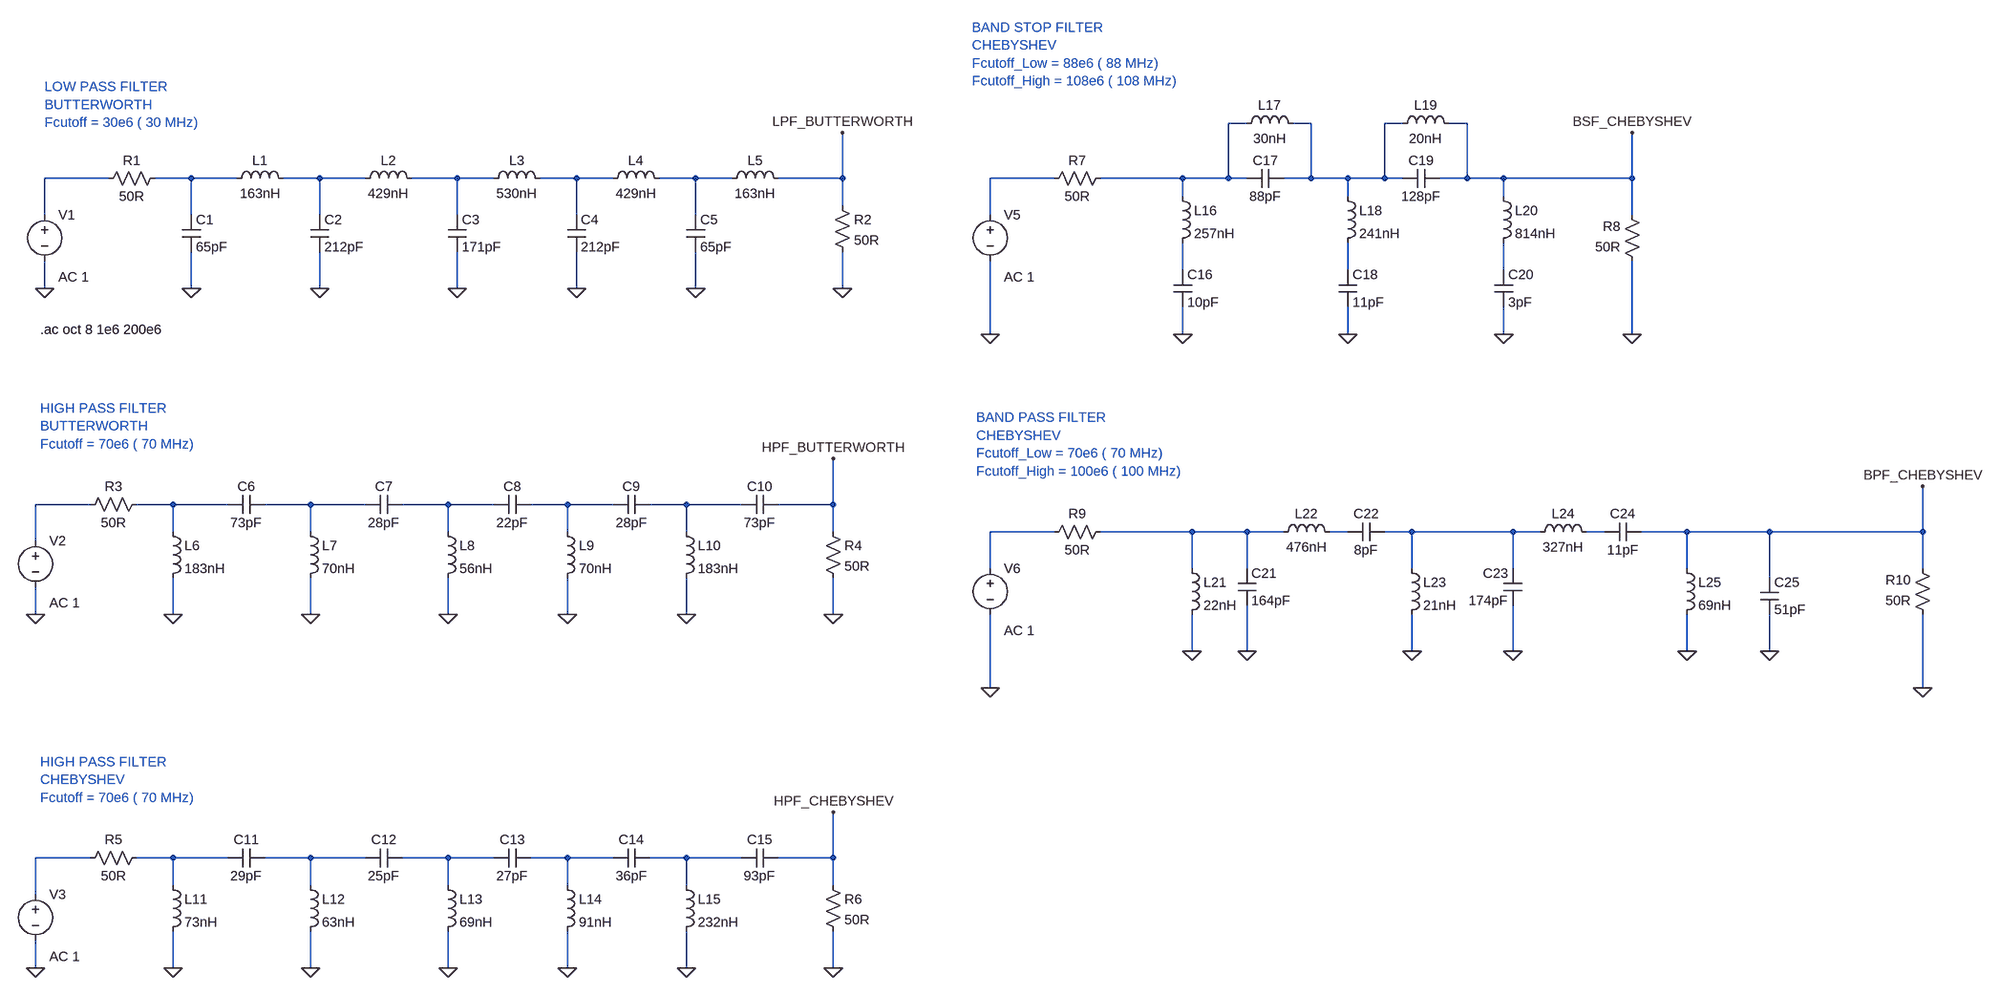
[diagram p0: schematic Filter_Simulations.asc]
Filter_Simulations.asc, the LTspice schematic file:
Version 4
SHEET 1 4708 1668
WIRE 2336 0 2304 0
WIRE 2448 0 2416 0
WIRE 2608 0 2576 0
WIRE 2720 0 2688 0
WIRE 240 96 128 96
WIRE 384 96 320 96
WIRE 464 96 384 96
WIRE 608 96 544 96
WIRE 688 96 608 96
WIRE 848 96 768 96
WIRE 912 96 848 96
WIRE 1056 96 992 96
WIRE 1120 96 1056 96
WIRE 1264 96 1200 96
WIRE 1328 96 1264 96
WIRE 1520 96 1520 16
WIRE 1520 96 1408 96
WIRE 2000 96 1888 96
WIRE 2224 96 2080 96
WIRE 2304 96 2304 0
WIRE 2304 96 2224 96
WIRE 2336 96 2304 96
WIRE 2448 96 2448 0
WIRE 2448 96 2400 96
WIRE 2512 96 2448 96
WIRE 2576 96 2576 0
WIRE 2576 96 2512 96
WIRE 2608 96 2576 96
WIRE 2720 96 2720 0
WIRE 2720 96 2672 96
WIRE 2784 96 2720 96
WIRE 3008 96 3008 16
WIRE 3008 96 2784 96
WIRE 2224 128 2224 96
WIRE 2512 128 2512 96
WIRE 2784 128 2784 96
WIRE 1520 144 1520 96
WIRE 128 160 128 96
WIRE 384 160 384 96
WIRE 608 160 608 96
WIRE 848 160 848 96
WIRE 1056 160 1056 96
WIRE 1264 160 1264 96
WIRE 1888 160 1888 96
WIRE 3008 160 3008 96
WIRE 2224 256 2224 208
WIRE 2512 256 2512 208
WIRE 2784 256 2784 208
WIRE 128 288 128 240
WIRE 384 288 384 224
WIRE 608 288 608 224
WIRE 848 288 848 224
WIRE 1056 288 1056 224
WIRE 1264 288 1264 224
WIRE 1520 288 1520 224
WIRE 1888 368 1888 240
WIRE 2224 368 2224 320
WIRE 2512 368 2512 320
WIRE 2784 368 2784 320
WIRE 3008 368 3008 240
WIRE 208 752 112 752
WIRE 352 752 288 752
WIRE 448 752 352 752
WIRE 592 752 512 752
WIRE 688 752 592 752
WIRE 832 752 752 752
WIRE 912 752 832 752
WIRE 1040 752 976 752
WIRE 1120 752 1040 752
WIRE 1248 752 1184 752
WIRE 1344 752 1248 752
WIRE 1504 752 1504 672
WIRE 1504 752 1408 752
WIRE 352 800 352 752
WIRE 592 800 592 752
WIRE 832 800 832 752
WIRE 1040 800 1040 752
WIRE 1248 800 1248 752
WIRE 1504 800 1504 752
WIRE 2000 800 1888 800
WIRE 2240 800 2080 800
WIRE 2336 800 2240 800
WIRE 2400 800 2336 800
WIRE 2512 800 2480 800
WIRE 2624 800 2576 800
WIRE 2800 800 2624 800
WIRE 2848 800 2800 800
WIRE 2960 800 2928 800
WIRE 3104 800 3024 800
WIRE 3248 800 3104 800
WIRE 3520 800 3520 720
WIRE 3520 800 3248 800
WIRE 112 816 112 752
WIRE 1888 864 1888 800
WIRE 2240 864 2240 800
WIRE 2336 864 2336 800
WIRE 2624 864 2624 800
WIRE 2800 864 2800 800
WIRE 3104 864 3104 800
WIRE 3520 864 3520 800
WIRE 3248 880 3248 800
WIRE 112 944 112 896
WIRE 352 944 352 880
WIRE 592 944 592 880
WIRE 832 944 832 880
WIRE 1040 944 1040 880
WIRE 1248 944 1248 880
WIRE 1504 944 1504 880
WIRE 2240 1008 2240 944
WIRE 2336 1008 2336 928
WIRE 2624 1008 2624 944
WIRE 2800 1008 2800 928
WIRE 3104 1008 3104 944
WIRE 3248 1008 3248 944
WIRE 1888 1072 1888 944
WIRE 3520 1072 3520 944
WIRE 208 1456 112 1456
WIRE 352 1456 288 1456
WIRE 448 1456 352 1456
WIRE 592 1456 512 1456
WIRE 688 1456 592 1456
WIRE 832 1456 752 1456
WIRE 912 1456 832 1456
WIRE 1040 1456 976 1456
WIRE 1120 1456 1040 1456
WIRE 1248 1456 1184 1456
WIRE 1344 1456 1248 1456
WIRE 1504 1456 1504 1376
WIRE 1504 1456 1408 1456
WIRE 352 1504 352 1456
WIRE 592 1504 592 1456
WIRE 832 1504 832 1456
WIRE 1040 1504 1040 1456
WIRE 1248 1504 1248 1456
WIRE 1504 1504 1504 1456
WIRE 112 1520 112 1456
WIRE 112 1648 112 1600
WIRE 352 1648 352 1584
WIRE 592 1648 592 1584
WIRE 832 1648 832 1584
WIRE 1040 1648 1040 1584
WIRE 1248 1648 1248 1584
WIRE 1504 1648 1504 1584
FLAG 128 288 0
FLAG 384 288 0
FLAG 608 288 0
FLAG 848 288 0
FLAG 1056 288 0
FLAG 1264 288 0
FLAG 1520 288 0
FLAG 112 944 0
FLAG 352 944 0
FLAG 592 944 0
FLAG 832 944 0
FLAG 1040 944 0
FLAG 1248 944 0
FLAG 1504 944 0
FLAG 112 1648 0
FLAG 352 1648 0
FLAG 592 1648 0
FLAG 832 1648 0
FLAG 1040 1648 0
FLAG 1248 1648 0
FLAG 1504 1648 0
FLAG 1520 16 LPF_BUTTERWORTH
FLAG 1504 672 HPF_BUTTERWORTH
FLAG 1504 1376 HPF_CHEBYSHEV
FLAG 3520 1072 0
FLAG 1888 1072 0
FLAG 2240 1008 0
FLAG 2336 1008 0
FLAG 2624 1008 0
FLAG 2800 1008 0
FLAG 3104 1008 0
FLAG 3248 1008 0
FLAG 3008 368 0
FLAG 1888 368 0
FLAG 2224 368 0
FLAG 2512 368 0
FLAG 2784 368 0
FLAG 3008 16 BSF_CHEBYSHEV
FLAG 3520 720 BPF_CHEBYSHEV
SYMBOL voltage 128 144 R0
WINDOW 123 24 124 Left 2
WINDOW 39 0 0 Left 0
SYMATTR Value2 AC 1
SYMATTR InstName V1
SYMATTR Value ""
SYMBOL res 336 80 R90
WINDOW 0 0 56 VBottom 2
WINDOW 3 32 56 VTop 2
SYMATTR InstName R1
SYMATTR Value 50R
SYMBOL cap 368 160 R0
SYMATTR InstName C1
SYMATTR Value 65pF
SYMBOL ind 448 112 R270
WINDOW 0 32 56 VTop 2
WINDOW 3 5 56 VBottom 2
SYMATTR InstName L1
SYMATTR Value 163nH
SYMBOL cap 592 160 R0
SYMATTR InstName C2
SYMATTR Value 212pF
SYMBOL ind 672 112 R270
WINDOW 0 32 56 VTop 2
WINDOW 3 5 56 VBottom 2
SYMATTR InstName L2
SYMATTR Value 429nH
SYMBOL ind 896 112 R270
WINDOW 0 32 56 VTop 2
WINDOW 3 5 56 VBottom 2
SYMATTR InstName L3
SYMATTR Value 530nH
SYMBOL ind 1104 112 R270
WINDOW 0 32 56 VTop 2
WINDOW 3 5 56 VBottom 2
SYMATTR InstName L4
SYMATTR Value 429nH
SYMBOL ind 1312 112 R270
WINDOW 0 32 56 VTop 2
WINDOW 3 5 56 VBottom 2
SYMATTR InstName L5
SYMATTR Value 163nH
SYMBOL cap 832 160 R0
SYMATTR InstName C3
SYMATTR Value 171pF
SYMBOL cap 1040 160 R0
SYMATTR InstName C4
SYMATTR Value 212pF
SYMBOL cap 1248 160 R0
SYMATTR InstName C5
SYMATTR Value 65pF
SYMBOL res 1504 128 R0
SYMATTR InstName R2
SYMATTR Value 50R
SYMBOL voltage 112 800 R0
WINDOW 123 24 124 Left 2
WINDOW 39 0 0 Left 0
SYMATTR Value2 AC 1
SYMATTR InstName V2
SYMATTR Value ""
SYMBOL res 304 736 R90
WINDOW 0 0 56 VBottom 2
WINDOW 3 32 56 VTop 2
SYMATTR InstName R3
SYMATTR Value 50R
SYMBOL ind 336 784 R0
SYMATTR InstName L6
SYMATTR Value 183nH
SYMBOL ind 576 784 R0
SYMATTR InstName L7
SYMATTR Value 70nH
SYMBOL ind 816 784 R0
SYMATTR InstName L8
SYMATTR Value 56nH
SYMBOL ind 1024 784 R0
SYMATTR InstName L9
SYMATTR Value 70nH
SYMBOL ind 1232 784 R0
SYMATTR InstName L10
SYMATTR Value 183nH
SYMBOL res 1488 784 R0
SYMATTR InstName R4
SYMATTR Value 50R
SYMBOL cap 512 736 R90
WINDOW 0 0 32 VBottom 2
WINDOW 3 32 32 VTop 2
SYMATTR InstName C6
SYMATTR Value 73pF
SYMBOL cap 752 736 R90
WINDOW 0 0 32 VBottom 2
WINDOW 3 32 32 VTop 2
SYMATTR InstName C7
SYMATTR Value 28pF
SYMBOL cap 976 736 R90
WINDOW 0 0 32 VBottom 2
WINDOW 3 32 32 VTop 2
SYMATTR InstName C8
SYMATTR Value 22pF
SYMBOL cap 1184 736 R90
WINDOW 0 0 32 VBottom 2
WINDOW 3 32 32 VTop 2
SYMATTR InstName C9
SYMATTR Value 28pF
SYMBOL cap 1408 736 R90
WINDOW 0 0 32 VBottom 2
WINDOW 3 32 32 VTop 2
SYMATTR InstName C10
SYMATTR Value 73pF
SYMBOL voltage 112 1504 R0
WINDOW 123 24 124 Left 2
WINDOW 39 0 0 Left 0
SYMATTR Value2 AC 1
SYMATTR InstName V3
SYMATTR Value ""
SYMBOL res 304 1440 R90
WINDOW 0 0 56 VBottom 2
WINDOW 3 32 56 VTop 2
SYMATTR InstName R5
SYMATTR Value 50R
SYMBOL ind 336 1488 R0
SYMATTR InstName L11
SYMATTR Value 73nH
SYMBOL ind 576 1488 R0
SYMATTR InstName L12
SYMATTR Value 63nH
SYMBOL ind 816 1488 R0
SYMATTR InstName L13
SYMATTR Value 69nH
SYMBOL ind 1024 1488 R0
SYMATTR InstName L14
SYMATTR Value 91nH
SYMBOL ind 1232 1488 R0
SYMATTR InstName L15
SYMATTR Value 232nH
SYMBOL res 1488 1488 R0
SYMATTR InstName R6
SYMATTR Value 50R
SYMBOL cap 512 1440 R90
WINDOW 0 0 32 VBottom 2
WINDOW 3 32 32 VTop 2
SYMATTR InstName C11
SYMATTR Value 29pF
SYMBOL cap 752 1440 R90
WINDOW 0 0 32 VBottom 2
WINDOW 3 32 32 VTop 2
SYMATTR InstName C12
SYMATTR Value 25pF
SYMBOL cap 976 1440 R90
WINDOW 0 0 32 VBottom 2
WINDOW 3 32 32 VTop 2
SYMATTR InstName C13
SYMATTR Value 27pF
SYMBOL cap 1184 1440 R90
WINDOW 0 0 32 VBottom 2
WINDOW 3 32 32 VTop 2
SYMATTR InstName C14
SYMATTR Value 36pF
SYMBOL cap 1408 1440 R90
WINDOW 0 0 32 VBottom 2
WINDOW 3 32 32 VTop 2
SYMATTR InstName C15
SYMATTR Value 93pF
SYMBOL voltage 1888 848 R0
WINDOW 123 24 124 Left 2
WINDOW 39 0 0 Left 0
SYMATTR Value2 AC 1
SYMATTR InstName V6
SYMATTR Value ""
SYMBOL res 2096 784 R90
WINDOW 0 0 56 VBottom 2
WINDOW 3 32 56 VTop 2
SYMATTR InstName R9
SYMATTR Value 50R
SYMBOL res 3536 960 R180
WINDOW 0 36 76 Left 2
WINDOW 3 36 40 Left 2
SYMATTR InstName R10
SYMATTR Value 50R
SYMBOL ind 2224 848 R0
SYMATTR InstName L21
SYMATTR Value 22nH
SYMBOL ind 2384 816 R270
WINDOW 0 32 56 VTop 2
WINDOW 3 5 56 VBottom 2
SYMATTR InstName L22
SYMATTR Value 476nH
SYMBOL ind 2608 848 R0
SYMATTR InstName L23
SYMATTR Value 21nH
SYMBOL ind 2832 816 R270
WINDOW 0 32 56 VTop 2
WINDOW 3 5 56 VBottom 2
SYMATTR InstName L24
SYMATTR Value 327nH
SYMBOL ind 3088 848 R0
SYMATTR InstName L25
SYMATTR Value 69nH
SYMBOL cap 2320 864 R0
SYMATTR InstName C21
SYMATTR Value 164pF
SYMBOL cap 2576 784 R90
WINDOW 0 0 32 VBottom 2
WINDOW 3 32 32 VTop 2
SYMATTR InstName C22
SYMATTR Value 8pF
SYMBOL cap 2816 928 R180
WINDOW 0 24 56 Left 2
WINDOW 3 24 8 Left 2
SYMATTR InstName C23
SYMATTR Value 174pF
SYMBOL cap 2960 816 R270
WINDOW 0 32 32 VTop 2
WINDOW 3 0 32 VBottom 2
SYMATTR InstName C24
SYMATTR Value 11pF
SYMBOL cap 3232 880 R0
SYMATTR InstName C25
SYMATTR Value 51pF
SYMBOL voltage 1888 144 R0
WINDOW 123 24 124 Left 2
WINDOW 39 0 0 Left 0
SYMATTR Value2 AC 1
SYMATTR InstName V5
SYMATTR Value ""
SYMBOL res 2096 80 R90
WINDOW 0 0 56 VBottom 2
WINDOW 3 32 56 VTop 2
SYMATTR InstName R7
SYMATTR Value 50R
SYMBOL res 3024 256 R180
WINDOW 0 36 76 Left 2
WINDOW 3 36 40 Left 2
SYMATTR InstName R8
SYMATTR Value 50R
SYMBOL ind 2208 112 R0
SYMATTR InstName L16
SYMATTR Value 257nH
SYMBOL cap 2208 256 R0
SYMATTR InstName C16
SYMATTR Value 10pF
SYMBOL ind 2320 16 R270
WINDOW 0 32 56 VTop 2
WINDOW 3 5 56 VBottom 2
SYMATTR InstName L17
SYMATTR Value 30nH
SYMBOL cap 2336 112 R270
WINDOW 0 32 32 VTop 2
WINDOW 3 0 32 VBottom 2
SYMATTR InstName C17
SYMATTR Value 88pF
SYMBOL ind 2496 112 R0
SYMATTR InstName L18
SYMATTR Value 241nH
SYMBOL cap 2496 256 R0
SYMATTR InstName C18
SYMATTR Value 11pF
SYMBOL ind 2592 16 R270
WINDOW 0 32 56 VTop 2
WINDOW 3 5 56 VBottom 2
SYMATTR InstName L19
SYMATTR Value 20nH
SYMBOL cap 2608 112 R270
WINDOW 0 32 32 VTop 2
WINDOW 3 0 32 VBottom 2
SYMATTR InstName C19
SYMATTR Value 128pF
SYMBOL ind 2768 112 R0
SYMATTR InstName L20
SYMATTR Value 814nH
SYMBOL cap 2768 256 R0
SYMATTR InstName C20
SYMATTR Value 3pF
TEXT 120 360 Left 2 !.ac oct 8 1e6 200e6
TEXT 128 -64 Left 2 ;LOW PASS FILTER\nBUTTERWORTH\nFcutoff = 30e6 ( 30 MHz)
TEXT 120 584 Left 2 ;HIGH PASS FILTER\nBUTTERWORTH\nFcutoff = 70e6 ( 70 MHz)
TEXT 120 1288 Left 2 ;HIGH PASS FILTER\nCHEBYSHEV\nFcutoff = 70e6 ( 70 MHz)
TEXT 1856 -168 Left 2 ;BAND STOP FILTER\nCHEBYSHEV\nFcutoff_Low = 88e6 ( 88 MHz)\nFcutoff_High = 108e6 ( 108 MHz)
TEXT 1864 600 Left 2 ;BAND PASS FILTER\nCHEBYSHEV\nFcutoff_Low = 70e6 ( 70 MHz)\nFcutoff_High = 100e6 ( 100 MHz)

The netlist it stands for:
* Filter_Simulations.asc
V1 N003 0 AC 1
R1 N004 N003 50R
C1 N004 0 65pF
L1 N004 N005 163nH
C2 N005 0 212pF
L2 N005 N006 429nH
L3 N006 N007 530nH
L4 N007 N008 429nH
L5 N008 LPF_BUTTERWORTH 163nH
C3 N006 0 171pF
C4 N007 0 212pF
C5 N008 0 65pF
R2 LPF_BUTTERWORTH 0 50R
V2 N013 0 AC 1
R3 N014 N013 50R
L6 N014 0 183nH
L7 N015 0 70nH
L8 N016 0 56nH
L9 N017 0 70nH
L10 N018 0 183nH
R4 HPF_BUTTERWORTH 0 50R
C6 N015 N014 73pF
C7 N016 N015 28pF
C8 N017 N016 22pF
C9 N018 N017 28pF
C10 HPF_BUTTERWORTH N018 73pF
V3 N024 0 AC 1
R5 N025 N024 50R
L11 N025 0 73nH
L12 N026 0 63nH
L13 N027 0 69nH
L14 N028 0 91nH
L15 N029 0 232nH
R6 HPF_CHEBYSHEV 0 50R
C11 N026 N025 29pF
C12 N027 N026 25pF
C13 N028 N027 27pF
C14 N029 N028 36pF
C15 HPF_CHEBYSHEV N029 93pF
V6 N019 0 AC 1
R9 N020 N019 50R
R10 0 BPF_CHEBYSHEV 50R
L21 N020 0 22nH
L22 N020 N021 476nH
L23 N022 0 21nH
L24 N022 N023 327nH
L25 BPF_CHEBYSHEV 0 69nH
C21 N020 0 164pF
C22 N022 N021 8pF
C23 0 N022 174pF
C24 N023 BPF_CHEBYSHEV 11pF
C25 BPF_CHEBYSHEV 0 51pF
V5 N009 0 AC 1
R7 N001 N009 50R
R8 0 BSF_CHEBYSHEV 50R
L16 N001 N010 257nH
C16 N010 0 10pF
L17 N001 N002 30nH
C17 N001 N002 88pF
L18 N002 N011 241nH
C18 N011 0 11pF
L19 N002 BSF_CHEBYSHEV 20nH
C19 N002 BSF_CHEBYSHEV 128pF
L20 BSF_CHEBYSHEV N012 814nH
C20 N012 0 3pF
.ac oct 8 1e6 200e6
* LOW PASS FILTER
* BUTTERWORTH
* Fcutoff = 30e6 ( 30 MHz)
* HIGH PASS FILTER
* BUTTERWORTH
* Fcutoff = 70e6 ( 70 MHz)
* HIGH PASS FILTER
* CHEBYSHEV
* Fcutoff = 70e6 ( 70 MHz)
* BAND STOP FILTER
* CHEBYSHEV
* Fcutoff_Low = 88e6 ( 88 MHz)
* Fcutoff_High = 108e6 ( 108 MHz)
* BAND PASS FILTER
* CHEBYSHEV
* Fcutoff_Low = 70e6 ( 70 MHz)
* Fcutoff_High = 100e6 ( 100 MHz)
.backanno
.end